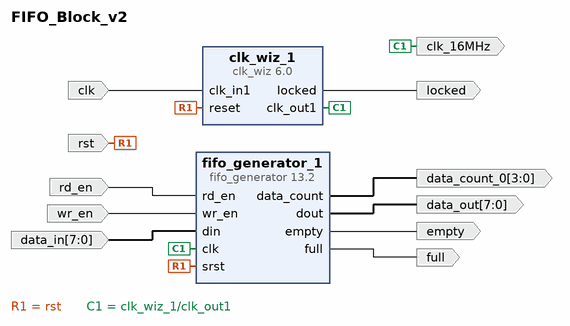
[diagram p0: block diagram of the top level]
# Vivado block design FIFO_Block_v2, xc7a100tcsg324-1, Vivado 2019.2
create_bd_design FIFO_Block_v2

create_bd_port -dir I -type clk clk
set_property -dict {CONFIG.FREQ_HZ 100000000} [get_bd_ports clk]
create_bd_port -dir O -from 3 -to 0 data_count_0
create_bd_port -dir O -from 7 -to 0 data_out
create_bd_port -dir O empty
create_bd_port -dir O full
create_bd_port -dir O locked
create_bd_port -dir I rd_en
create_bd_port -dir I -type rst rst
set_property -dict {CONFIG.POLARITY ACTIVE_HIGH} [get_bd_ports rst]
create_bd_port -dir I wr_en
create_bd_port -dir O clk_16MHz
create_bd_port -dir I -from 7 -to 0 data_in

create_bd_cell -type ip -vlnv xilinx.com:ip:clk_wiz:6.0 clk_wiz_1
set_property -dict [list \
  CONFIG.CLKOUT1_DRIVES BUFGCE \
  CONFIG.CLKOUT1_JITTER 382.856 \
  CONFIG.CLKOUT1_PHASE_ERROR 307.118 \
  CONFIG.CLKOUT1_REQUESTED_OUT_FREQ 16.0 \
  CONFIG.CLKOUT2_DRIVES BUFGCE \
  CONFIG.CLKOUT3_DRIVES BUFGCE \
  CONFIG.CLKOUT4_DRIVES BUFGCE \
  CONFIG.CLKOUT5_DRIVES BUFGCE \
  CONFIG.CLKOUT6_DRIVES BUFGCE \
  CONFIG.CLKOUT7_DRIVES BUFGCE \
  CONFIG.FEEDBACK_SOURCE FDBK_AUTO \
  CONFIG.MMCM_BANDWIDTH OPTIMIZED \
  CONFIG.MMCM_CLKFBOUT_MULT_F 44 \
  CONFIG.MMCM_CLKOUT0_DIVIDE_F 55 \
  CONFIG.MMCM_COMPENSATION ZHOLD \
  CONFIG.MMCM_DIVCLK_DIVIDE 5 \
  CONFIG.PRIMITIVE PLL \
  CONFIG.USE_SAFE_CLOCK_STARTUP true \
] [get_bd_cells clk_wiz_1]
create_bd_cell -type ip -vlnv xilinx.com:ip:fifo_generator:13.2 fifo_generator_1
set_property -dict [list \
  CONFIG.Almost_Empty_Flag false \
  CONFIG.Almost_Full_Flag false \
  CONFIG.Data_Count true \
  CONFIG.Data_Count_Width 4 \
  CONFIG.Input_Data_Width 8 \
  CONFIG.Input_Depth 16 \
  CONFIG.Output_Data_Width 8 \
  CONFIG.Reset_Type Synchronous_Reset \
] [get_bd_cells fifo_generator_1]

# ---- connections ----

connect_bd_net [get_bd_ports rst] [get_bd_pins clk_wiz_1/reset] [get_bd_pins fifo_generator_1/srst]
connect_bd_net -net clk_100MHz_1 [get_bd_ports clk] [get_bd_pins clk_wiz_1/clk_in1]
connect_bd_net -net clk_wiz_0_clk_out1 [get_bd_pins clk_wiz_1/clk_out1] [get_bd_pins fifo_generator_1/clk] [get_bd_ports clk_16MHz]
connect_bd_net -net clk_wiz_0_locked [get_bd_pins clk_wiz_1/locked] [get_bd_ports locked]
connect_bd_net -net data_in1_1 [get_bd_ports rd_en] [get_bd_pins fifo_generator_1/rd_en]
connect_bd_net -net fifo_generator_0_dout [get_bd_pins fifo_generator_1/dout] [get_bd_ports data_out]
connect_bd_net -net fifo_generator_0_empty [get_bd_pins fifo_generator_1/empty] [get_bd_ports empty]
connect_bd_net -net fifo_generator_0_full [get_bd_pins fifo_generator_1/full] [get_bd_ports full]
connect_bd_net [get_bd_ports wr_en] [get_bd_pins fifo_generator_1/wr_en]
connect_bd_net [get_bd_ports data_in] [get_bd_pins fifo_generator_1/din]
connect_bd_net [get_bd_pins fifo_generator_1/data_count] [get_bd_ports data_count_0]

validate_bd_design
save_bd_design
